# EAGLE design Adafruit PowerRelay Wing (EAGLE 6.6.0)
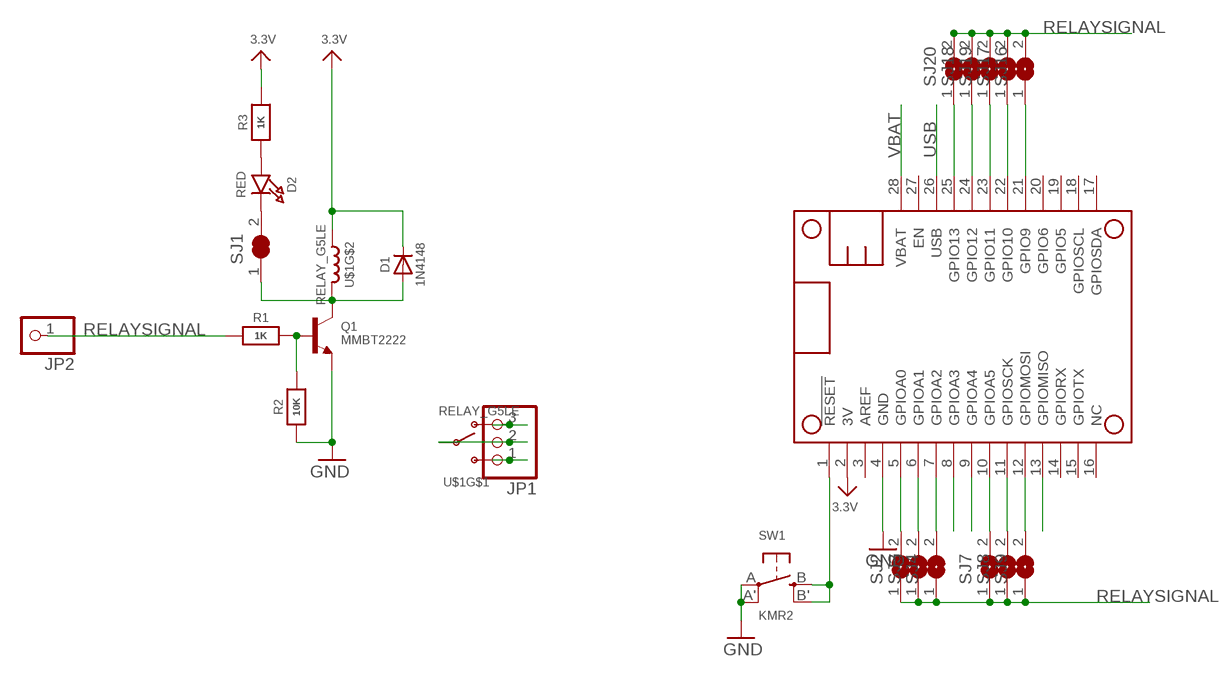
[diagram p0: schematic, sheet 1]

## Parts
D1  1N4148  DIODESOD-323  [SOD-323]
D2  RED  LED0805_NOOUTLINE  [CHIPLED_0805_NOOUTLINE]
JP1  HEADER-1X3_508TERM  [TERMBLOCK_1X3_5.08MM]
JP2  HEADER-1X1ROUND  [1X01_ROUND]
MS2  FEATHERWING  [FEATHERWING]
Q1  MMBT2222  TRANSISTOR_NPN  [SOT23-R]
R1  1K  RESISTOR0805_NOOUTLINE  [0805-NO]
R2  10K  RESISTOR0805_NOOUTLINE  [0805-NO]
R3  1K  RESISTOR0805_NOOUTLINE  [0805-NO]
SJ1  SOLDERJUMPER_CLOSED  [SOLDERJUMPER_CLOSEDWIRE]
SJ2  SOLDERJUMPER  [SOLDERJUMPER_ARROW_NOPASTE]
SJ3  SOLDERJUMPER  [SOLDERJUMPER_ARROW_NOPASTE]
SJ4  SOLDERJUMPER  [SOLDERJUMPER_ARROW_NOPASTE]
SJ7  SOLDERJUMPER  [SOLDERJUMPER_ARROW_NOPASTE]
SJ8  SOLDERJUMPER  [SOLDERJUMPER_ARROW_NOPASTE]
SJ9  SOLDERJUMPER  [SOLDERJUMPER_ARROW_NOPASTE]
SJ16  SOLDERJUMPER  [SOLDERJUMPER_ARROW_NOPASTE]
SJ17  SOLDERJUMPER  [SOLDERJUMPER_ARROW_NOPASTE]
SJ18  SOLDERJUMPER  [SOLDERJUMPER_ARROW_NOPASTE]
SJ19  SOLDERJUMPER  [SOLDERJUMPER_ARROW_NOPASTE]
SJ20  SOLDERJUMPER  [SOLDERJUMPER_ARROW_NOPASTE]
SW1  KMR2  SWITCH_TACT_SMT4.6X2.8  [BTN_KMR2_4.6X2.8]
U$1  RELAY_G5LE  [RELAY_G5LE-1]

## Nets
3.3V: D1.C MS2.2(3V) R3.2 U$1.2
GND: MS2.4(GND) Q1.2(E) R2.1 SW1.A'(P1) SW1.A(P)
N$1: JP1.2 U$1.1(P)
N$2: JP1.3 U$1.3(O)
N$3: JP1.1 U$1.4(S)
N$4: D1.A Q1.3(C) SJ1.1 U$1.5
N$7: MS2.13(GPIOMISO)
N$8: MS2.12(GPIOMOSI) SJ9.2
N$9: MS2.11(GPIOSCK) SJ8.2
N$10: MS2.10(GPIOA5) SJ7.2
N$11: MS2.9(GPIOA4)
N$12: MS2.8(GPIOA3)
N$13: MS2.7(GPIOA2) SJ4.2
N$14: MS2.6(GPIOA1) SJ3.2
N$15: MS2.5(GPIOA0) SJ2.2
N$16: MS2.25(GPIO13) SJ20.1
N$17: MS2.24(GPIO12) SJ18.1
N$18: MS2.1(!RESET) SW1.B'(S1) SW1.B(S)
N$19: MS2.23(GPIO11) SJ19.1
N$20: MS2.22(GPIO10) SJ17.1
N$21: MS2.21(GPIO9) SJ16.1
N$22: Q1.1(B) R1.2 R2.2
N$25: D2.C SJ1.2
N$26: D2.A R3.1
RELAYSIGNAL: JP2.1 R1.1 SJ2.1 SJ3.1 SJ4.1 SJ7.1 SJ8.1 SJ9.1 SJ16.2 SJ17.2 SJ18.2 SJ19.2 SJ20.2
USB: MS2.26(USB)
VBAT: MS2.28(VBAT)
Unconnected: MS2.3(AREF) MS2.14(GPIORX) MS2.15(GPIOTX) MS2.16(NC) MS2.17(GPIOSDA) MS2.18(GPIOSCL) MS2.19(GPIO5) MS2.20(GPIO6) MS2.27(EN)

## Library data of the parts
D1 = microbuilder:DIODE: Diode SMA Model Volts Amps Type Vf Ir Digikey # Notes SSA34-E3 40V 3A Schottky 480mV @ 3A 200uA @ 40V SSA34-E3/61TGITR-ND CDBA120-G 20V 1A Schottky 500mV @ 1A 500uA @ 20V 641-1014-6-ND REEL MBRA210 10V 2A Schottky 350mV @ 2A 700uA @ 10V MBRA210LT3 SOD-123 Model Volts Amps Type Vf Ir Order # Notes BAT54T1G 30V 200mA Schottky 800mV @ 200mA 2uA @ 25V BAT54T1GOSTR-ND B0530W 30V 500mA Schottky 430mV @ 500mA 130uA @ 30V B0530W-FDICT-ND REEL MBR120 20V 1A Schottky 340mV @ 1A MBR120VLSFT1GOSCT-ND SOD-323 Model Volts Amps Type Vf Ir Order # Notes PMEG2005EJ 20V 500mA Schottky 355mV @ 500mA 568-4110-1-ND ZLLS410 10V 570mA Schottky 380mV @ 570mA ZLLS410CT-ND 1N4148WS 75V 150mA Silicon/Simple 1V 1N4148WSFSCT-ND REEL SOD-523 Model Volts Amps Type Vf Ir Order # Notes BAT54XV2 30V 200mA Schottky 0.8V @ 100mA BAT54XV2CT-ND TB751S 30V 30mA Schottky RB751S-40TE61CT-ND SOT23-R/W (R = Solder Paste/Reflow Ovens, W = Hand-Soldering) Model Volts Amps Type Vf Ir Order # Notes BAT54FILM 40V 300mA Schottky 497-7162-1-ND POWERDI-5 Model Volts Amps Type Vf Ir Order # Notes PDS560 60V 5A Schottky 670mV @ 5A 150uA @ 60V PDS560DICT-ND
D2 = microbuilder:LED: LED 0603 - 0603 Surface Mount Package 2mA: Green LED - Low Power (3.9mcd, 2ma, 1.7Vf) - Digikey: 475-2709-2-ND Orange LED - Low Power (9.8mcd, 2ma, 1.8Vf) - Digikey: 475-1194-2-ND Red LED - Low Power (5mcd, 2ma, 1.8Vf) - Digikey: 475-1195-2-ND Yellow LED - Low Power (7mcd, 2ma, 1.8Vf) - Digikey: 475-1196-2-ND 5mA: Blue LED - Low Power (17mcd, 5ma, 2.9Vf) - Digikey: LNJ937W8CRACT-ND 0805 - 0805 Surface Mount Package 2mA: Red LED (8.8mcd, 2mA, 1.8Vf, Clear) - Low Power [Digikey: 475-2510-1-ND] Green LED (5mcd, 2mA, 1.8Vf, Clear) - Low Power [Digikey: 475-2730-1-ND] Yellow LED (11.3mcd, 2mA, 1.8Vf, Clear) - Low Power [Digikey: 475-2555-1-ND] 20mA: Red LED (104mcd, 20mA, Diffused) - LS R976 [Digikey: 475-1278-6-ND] Red LED (12mcd, 20mA, 2.0Vf, Clear) - APT2012EC [Digikey: 754-1128-1-ND] Green LED (15mcd, 20mA, 2.2Vf, Clear) - APT2012GC [Digikey: 754-1131-1-ND] Orange LED (160mcd, 20mA, 2.1Vf, Clear) - APT2012SECK [Digikey: 754-1130-1-ND] 1206 - 1206 Surface Mount Package Green LED (26mcd, 20mA, Diffused) - LG N971 [Digikey: 475-1407-6-ND] Red LED (15mcd, 20mA, Diffused) - LH N974 [Digikey: 475-1416-6-ND] Cree - Cree High-Power Surface Mount LEDs XPEBWT-L1-0000-00D50 - White 111lm 350mA 2.9Vf 6200K 110° XTEAWT-00-0000-00000LEE3 - White 114lm 350mA 2.85Vf 5000K 115° Everlight - Everlight 45-21 Series Surface Mount LEDs 45-21/QK2C-B2832AC2CB2/2T - Warm White 2000mcd 20mA 3.25Vf 3050K 120° 45-21/LK2C-B38452C4CB2/2T - Nuetral White 2000mcd 20mA 3.25Vf 4150K 120° 45-21/LK2C-B50634C6CB2/2T - Cold White 2200mcd 20mA 3.25Vf 5650K 120° PLCC2 Reverse Mount LS T77K-J1L2-1-0-2-R18-Z - Red 11.25mcd 2mA 1.8Vf 630nm 120° LO T77K-L1M2-24-Z - Orange 19.6mcd 2mA 1.8Vf 606nm 120° LY T77K-K2M1-26-Z - Yellow 15.7mcd 2mA 1.8Vf 587nm 120°
JP1 = microbuilder:HEADER-1X3: PIN HEADER
JP2 = microbuilder:HEADER-1X1: PIN HEADER
MS2 = microbuilder:FEATHERWING
Q1 = microbuilder:TRANSISTOR_NPN: NPN Transistor Transistor (NPN) 500mA 45V - BC817 [Digikey: 568-1631-1-ND] Transistor (NPN) 500mA 45V - BC817,215 [Mouser: 771-BC817-T/R] SOT23-R - SOT23 footprint optimised for use with solder paste and reflow ovens. SOT23-W - SOT23 footprint optimised for hand-soldering (larger pads).
R1-R3 = microbuilder:RESISTOR: Resistors For new designs, use the packages preceded by an '_' character since they are more reliable: The following footprints should be used on most boards: _0402 - Standard footprint for regular board layouts _0603 - Standard footprint for regular board layouts _0805 - Standard footprint for regular board layouts _1206 - Standard footprint for regular board layouts For extremely tight-pitch boards where space is at a premium, the following 'micro-pitch' footprints can be used (smaller pads, no silkscreen outline, etc.): _0402MP - Micro-pitch footprint for very dense/compact boards _0603MP - Micro-pitch footprint for very dense/compact boards _0805MP - Micro-pitch footprint for very dense/compact boards _1206MP - Micro-pitch footprint for very dense/compact boards
SJ1 = microbuilder:SOLDERJUMPER_CLOSED: Solder Jumper - Closed These solder jumpers are closed by default CLOSEDWIRE - 10 mil trace between pads that can be cut and resoldered later CLOSEDPERM - 63 mil trace between pads for a permanent connection (used to 'bridge' two signals, a shameless hack for Eagle). Can double as a test point as well (no cream layer)
SJ2-SJ4 SJ7-SJ9 SJ16-SJ20 = microbuilder:SOLDERJUMPER: SMD Solder JUMPER Solder the two pads together to create a connection, or remove the solder to break it. REFLOW - Use this footprint for solder paste and reflow ovens. WAVE - Use this footprint for hand-soldering (larger pads). CLOSED - Has a trace between the two pads to ensure it is closed by default. The trace needs to be cut to disable the jumper, and can be closed again by creating a solder bridge between the two pads.; BOM: EXCLUDE
SW1 = microbuilder:SWITCH_TACT_SMT: SMT Tact Switches 6x6mm - Digikey: P12940SCT-ND KMR2 (4.6x2.8mm) - Digikey: 401-1426-1-ND EVQ-PQHB55 - Light Touch, 160GF (4.5x4.5mm) - Digikey: P8090SCT-ND KMT0 - KMT021 NGJ LHS (etc.) IP68/Waterproof - Digikey: CKN10289CT-ND
U$1 = microbuilder:RELAY_G5LE

## Board
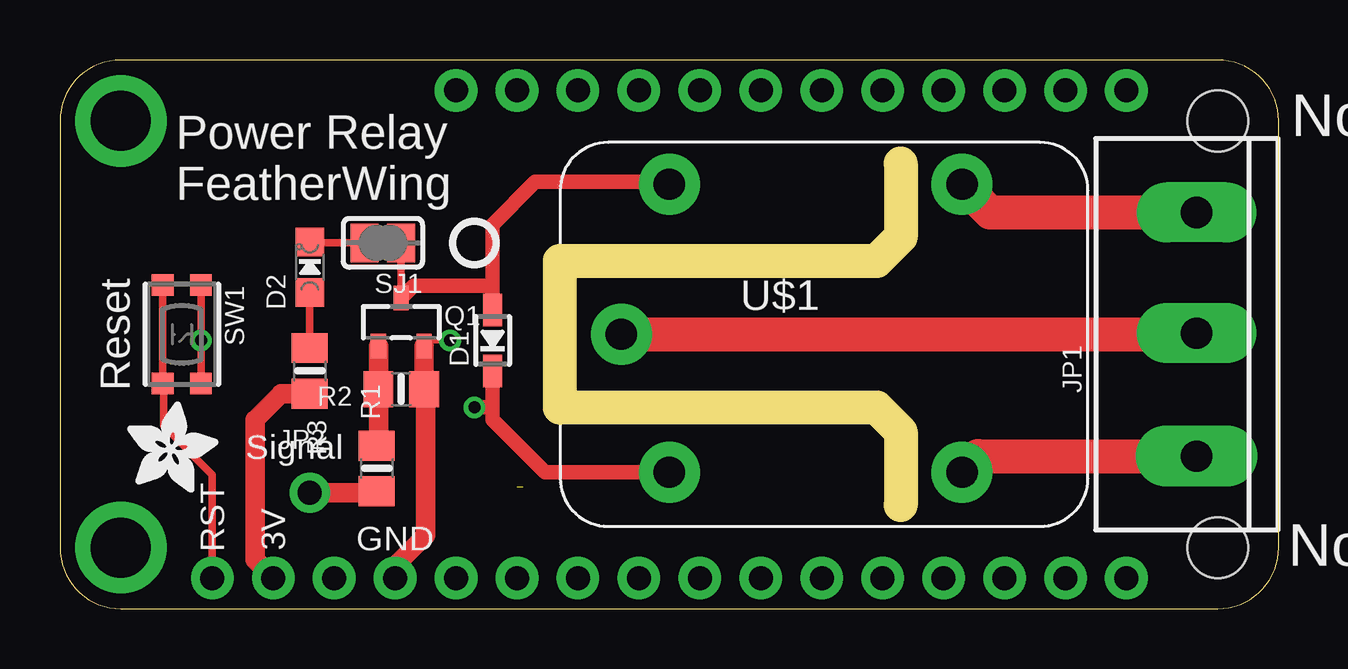
[diagram p1: board, top side]
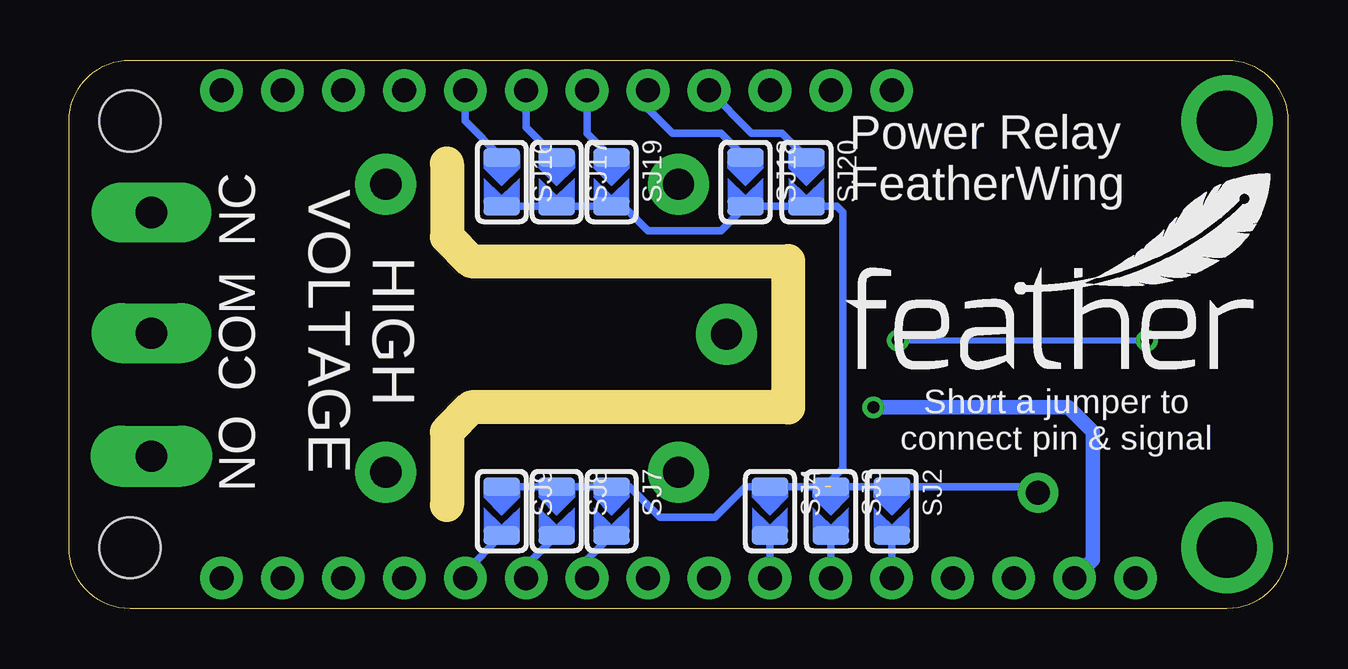
[diagram p2: board, bottom side, seen from below]

Size 50.8 x 22.86 mm. Coordinates in mm from the lower left corner, seen from the top.
Outline: 35.05,18.54 35.05,15.49 34.04,14.48 20.83,14.48 20.83,8.38 34.04,8.38 35.05,7.37 35.05,4.32
Copper layers (1*16): Top 0.035mm / dielectric 1.5mm / Bottom 0.035mm
Design rules "adafruit": minimum track width 8mil, minimum drill 15.5mil, track to track 8mil, track to pad 8mil, pad to pad 8mil, via to via 8mil, smd to smd 8mil, copper to edge 10mil, drill to drill 8mil, minimum pad ring 10mil, minimum via ring 8mil, stop-mask expansion 2mil, vias tented up to drill 20mil, thermal gap 10mil

### Footprints (pad centres in the part's own frame; a part is rotated, then mirrored left to right if it is on the bottom)
SOD-323 = smd 1.35 x 0.8: A 1.27,0; C -1.27,0
CHIPLED_0805_NOOUTLINE = smd 1.2 x 1.2: A 0,-1.05; C 0,1.05
TERMBLOCK_1X3_5.08MM = drill 1.3 pad 2.5 long: 1 5.08,0; 2 0.05,0 | drill 1.3 pad 2.54 long: 3 -5.08,0
1X01_ROUND = drill 1 pad 1.676: 1 0,0
FEATHERWING = drill 1 pad 1.778: 1 6.35,1.27; 2 8.89,1.27; 3 11.43,1.27; 4 13.97,1.27; 5 16.51,1.27; 6 19.05,1.27; 7 21.59,1.27; 8 24.13,1.27; 9 26.67,1.27; 10 29.21,1.27; 11 31.75,1.27; 12 34.29,1.27; 13 36.83,1.27; 14 39.37,1.27; 15 41.91,1.27; 16 44.45,1.27; 17 44.45,21.59; 18 41.91,21.59; 19 39.37,21.59; 20 36.83,21.59; 21 34.29,21.59; 22 31.75,21.59; 23 29.21,21.59; 24 26.67,21.59; 25 24.13,21.59; 26 21.59,21.59; 27 19.05,21.59; 28 16.51,21.59 | drill 2.5 pad 3.81: P$1 2.54,20.32; P$2 2.54,2.54 | hole 2.54: 48.26,20.32; 48.26,2.54
SOT23-R = smd 0.635 x 1.016: 1 -0.95,-1; 2 0.95,-1; 3 0,1
0805-NO = smd 1.24 x 1.5: 1 -0.95,0; 2 0.95,0
SOLDERJUMPER_CLOSEDWIRE = smd 1.168 x 1.6: 1 -0.762,0; 2 0.762,0 | smd 0.635 x 0.203: WIRE 0,0
SOLDERJUMPER_ARROW_NOPASTE = smd 0.762 x 1.524: 1 -1.016,0; 2 1.016,0
BTN_KMR2_4.6X2.8 = smd 0.9 x 0.9: A 2.05,0.8; A' -2.05,0.8; B 2.05,-0.8; B' -2.05,-0.8
RELAY_G5LE-1 = drill 1.3 pad 2.54: 1 -8.35,0; 2 -6.35,-5.75; 3 5.85,-5.75; 4 5.85,6.25; 5 -6.35,6.25

### Placement (x,y rotation side)
D1  18.03,11.18 90 top
D2  10.41,14.22 0 top
JP1  47.37,11.43 90 top
JP2  10.41,4.83 0 top
MS2  0,0 0 top
Q1  14.22,11.94 0 top
R1  13.21,5.84 90 top
R2  14.22,9.14 180 top
R3  10.41,9.91 270 top
SJ1  13.46,15.24 180 top
SJ2  16.51,4.06 270 bottom
SJ3  19.05,4.06 270 bottom
SJ4  21.59,4.06 270 bottom
SJ7  28.19,4.06 270 bottom
SJ8  30.48,4.06 270 bottom
SJ9  32.77,4.06 270 bottom
SJ16  32.77,17.78 270 bottom
SJ17  30.48,17.78 270 bottom
SJ18  22.61,17.78 270 bottom
SJ19  28.19,17.78 270 bottom
SJ20  20.07,17.78 270 bottom
SW1  5.08,11.43 270 top
U$1  31.75,11.43 0 top
U$5  [PCBFEAT-REV-040]  17.27,15.24 0 top
U$6  [ADAFRUIT_3.5MM]  2.79,4.83 0 top
U$7  [FEATHERLOGO_MED]  18.54,9.91 0 bottom

### Tracks (layer width: path | path; a pad name or v marks a point on that pad's centre or on a via)
3.3V  (via drill 0.5)
  Top 0.61: U$1.2 20.23,5.68 18.03,7.87 18.03,8.38 | v17.27,8.38 18.03,8.38 | 18.03,8.38 D1.C
  Top 0.813: MS2.2 8.13,2.03 8.13,7.87 9.21,8.96 R3.2
  Bottom 0.61: MS2.2 8.13,2.03 8.13,7.37 9.14,8.38 v17.27,8.38
GND  (via drill 0.5)
  Top 0.254: Q1.2 15.41,11.18 v16.26,11.18
  Top 0.305: SW1.A v5.88,11.18 SW1.A'
  Top 0.813: MS2.4 13.97,1.78 15.24,3.05 15.24,9.08 R2.1 Q1.2
  Bottom 0.254: v16.26,11.18 v5.88,11.18
N$1
  Top 1.422: U$1.1 46.99,11.43 47.04,11.48 JP1.2
N$2
  Top 1.422: U$1.3 38.27,6.35 JP1.3
N$3
  Top 1.422: U$1.4 38.77,16.51 JP1.1
N$4
  Top 0.305: SJ1.1 Q1.3
  Top 0.61: D1.A 18.03,13.46 | 18.03,13.46 18.03,16 19.81,17.78 25.3,17.78 U$1.5 | Q1.3 14.75,13.46 18.03,13.46
N$8
  Bottom 0.305: SJ9.2 34.29,1.52 MS2.12
N$9
  Bottom 0.305: SJ8.2 31.75,1.78 MS2.11
N$10
  Bottom 0.305: SJ7.2 29.21,2.03 MS2.10
N$13
  Bottom 0.305: SJ4.2 MS2.7
N$14
  Bottom 0.305: SJ3.2 MS2.6
N$15
  Bottom 0.305: SJ2.2 MS2.5
N$16
  Bottom 0.305: SJ20.1 21.08,19.81 22.35,19.81 MS2.25
N$17
  Bottom 0.305: SJ18.1 23.62,19.81 25.65,19.81 26.67,20.83 MS2.24
N$18
  Top 0.305: MS2.1 6.35,5.59 4.32,7.62 4.32,9.34 SW1.B SW1.B'
N$19
  Bottom 0.305: SJ19.1 29.21,19.81 MS2.23
N$20
  Bottom 0.305: SJ17.1 31.75,20.07 MS2.22
N$21
  Bottom 0.305: SJ16.1 34.29,20.32 MS2.21
N$22
  Top 0.813: Q1.1 R2.2 13.27,6.86 R1.2
N$25
  Top 0.305: D2.C 10.45,15.24 SJ1.2
N$26
  Top 0.305: R3.1 D2.A
RELAYSIGNAL  (1 unrouted)
  Top 0.813: JP2.1 13.14,4.83 R1.1
  Bottom 0.305: SJ9.1 SJ8.1 SJ7.1 27.43,5.08 26.16,3.81 23.88,3.81 22.61,5.08 SJ4.1 SJ3.1 SJ2.1 10.67,5.08 JP2.1 | SJ16.2 SJ17.2 SJ19.2 27.69,16.76 26.67,15.75 23.62,15.75 SJ18.2 SJ20.2 18.8,16.76 18.54,16.51 18.54,5.84 19.3,5.08

### Text on the board
tPlace: Non-Plated Hole | Power Relay / FeatherWing | Reset | Signal | RST | 3V | GND | Non-Plated Hole
bPlace: Power Relay / FeatherWing | NC | HIGH / VOLTAGE | COM | Short a jumper to / connect pin & signal | NO